# Altium schematic sheet io.SchDoc
size A; SheetNumber: 1; SheetTotal: 7
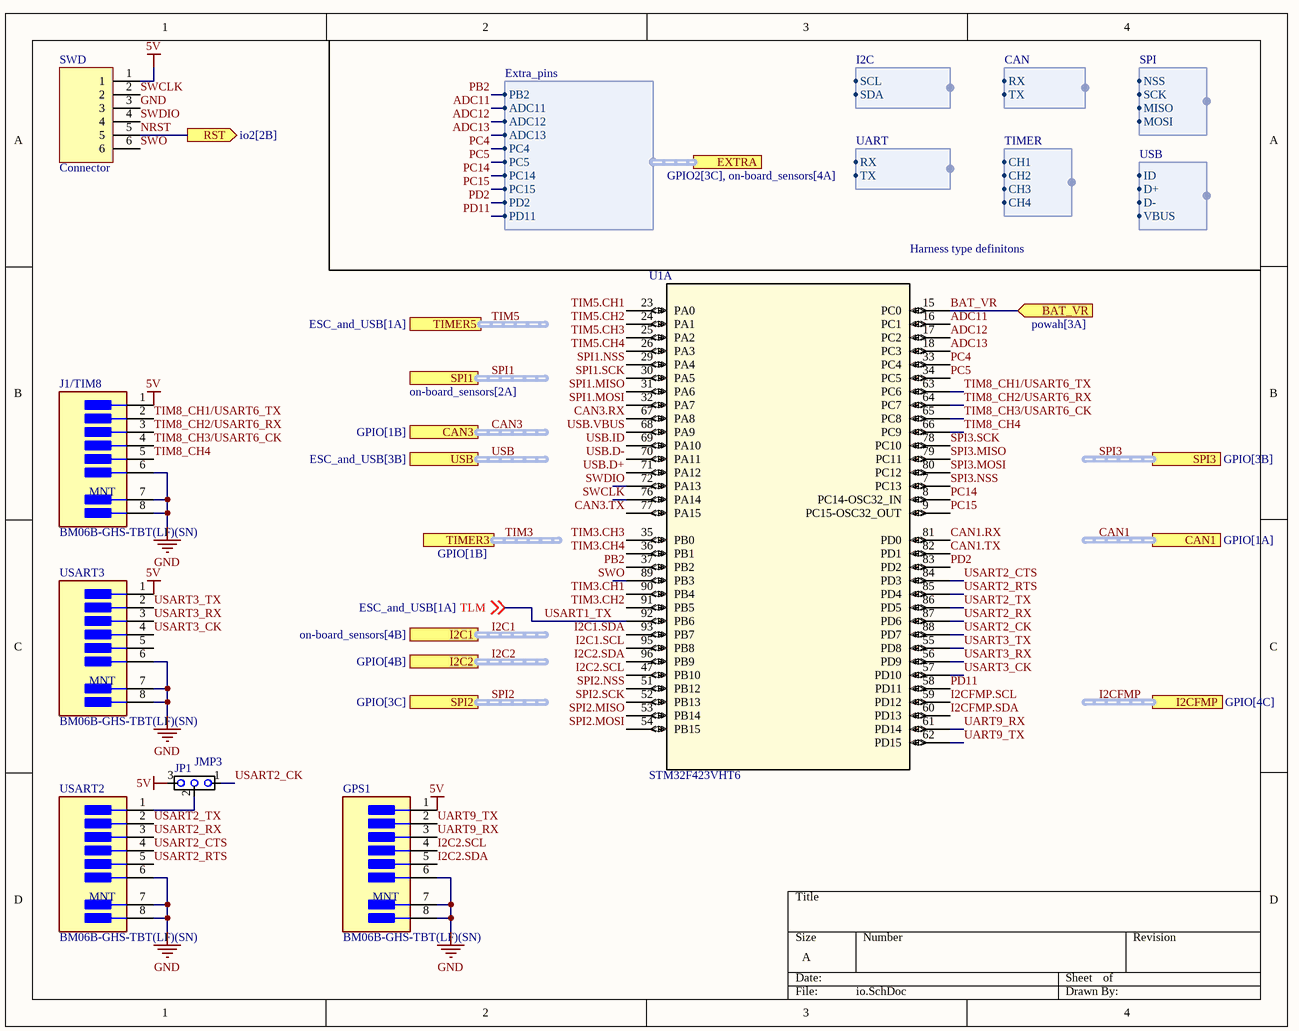
[diagram p0: io.SchDoc]

## Parts
GPS1  BM06B-GHS-TBT(LF)(SN)  [FP-SM06B-GHS-TB_LF_SN-MFG]
J1/TIM8  BM06B-GHS-TBT(LF)(SN)  [FP-SM06B-GHS-TB_LF_SN-MFG]
JP1  JMP3  [JMP3]
SWD  Connector  [FP_CONN6_TAP_254MM]
U1  STM32F423VHT6  [LQFP100-14x14mm]  (part A of 3)
USART2  BM06B-GHS-TBT(LF)(SN)  [FP-SM06B-GHS-TB_LF_SN-MFG]
USART3  BM06B-GHS-TBT(LF)(SN)  [FP-SM06B-GHS-TB_LF_SN-MFG]

## Ports
BAT_VR (in, see powah[3A]), CAN1 (harness CAN, see GPIO[1A]), CAN3 (harness CAN, see GPIO[1B]), EXTRA (harness Extra_pins, see GPIO2[3C], on-board_sensors[4A]), I2C1 (harness I2C, see on-board_sensors[4B]), I2C2 (harness I2C, see GPIO[4B]), I2CFMP (harness I2C, see GPIO[4C]), RST (out, see io2[2B]), SPI1 (harness SPI, see on-board_sensors[2A]), SPI2 (harness SPI, see GPIO[3C]), SPI3 (harness SPI, see GPIO[3B]), TIMER3 (harness TIMER, see GPIO[1B]), TIMER5 (harness TIMER, see ESC_and_USB[1A]), USB (harness USB, see ESC_and_USB[3B])

## Harnesses
USB: ID, D+, D-, VBUS
SPI: NSS, SCK, MISO, MOSI
TIMER: CH1, CH2, CH3, CH4
CAN: RX, TX
I2C: SCL, SDA
Extra_pins: PB2, ADC11, ADC12, ADC13, PC4, PC5, PC14, PC15, PD2, PD11
UART: RX, TX

## Nets
5V: GPS1.1 J1/TIM8.1 JP1.3 SWD.1 USART3.1
GND: GPS1.6 GPS1.7(MNT_1) GPS1.8(MNT_2) J1/TIM8.6 J1/TIM8.7(MNT_1) J1/TIM8.8(MNT_2) SWD.3 USART2.6 USART2.7(MNT_1) USART2.8(MNT_2) USART3.6 USART3.7(MNT_1) USART3.8(MNT_2)
ADC11: U1.16(PC1) ; port EXTRA.ADC11
ADC12: U1.17(PC2) ; port EXTRA.ADC12
ADC13: U1.18(PC3) ; port EXTRA.ADC13
BAT_VR: U1.15(PC0) ; port BAT_VR
CAN1.RX: U1.81(PD0)
CAN1.TX: U1.82(PD1)
CAN3.RX: U1.67(PA8)
CAN3.TX: U1.77(PA15)
I2C1.SCL: U1.95(PB8)
I2C1.SDA: U1.93(PB7)
I2C2.SCL: GPS1.4 U1.47(PB10)
I2C2.SDA: GPS1.5 U1.96(PB9)
I2CFMP.SCL: U1.59(PD12)
I2CFMP.SDA: U1.60(PD13)
NRST: SWD.5 ; port RST
PB2: U1.37(PB2) ; port EXTRA.PB2
PC4: U1.33(PC4) ; port EXTRA.PC4
PC5: U1.34(PC5) ; port EXTRA.PC5
PC14: U1.8(PC14-OSC32_IN) ; port EXTRA.PC14
PC15: U1.9(PC15-OSC32_OUT) ; port EXTRA.PC15
PD2: U1.83(PD2) ; port EXTRA.PD2
PD11: U1.58(PD11) ; port EXTRA.PD11
SPI1.MISO: U1.31(PA6)
SPI1.MOSI: U1.32(PA7)
SPI1.NSS: U1.29(PA4)
SPI1.SCK: U1.30(PA5)
SPI2.MISO: U1.53(PB14)
SPI2.MOSI: U1.54(PB15)
SPI2.NSS: U1.51(PB12)
SPI2.SCK: U1.52(PB13)
SPI3.MISO: U1.79(PC11)
SPI3.MOSI: U1.80(PC12)
SPI3.NSS: U1.7(PC13)
SPI3.SCK: U1.78(PC10)
SWCLK: SWD.2 U1.76(PA14)
SWDIO: SWD.4 U1.72(PA13)
SWO: SWD.6 U1.89(PB3)
TIM3.CH1: U1.90(PB4)
TIM3.CH2: U1.91(PB5)
TIM3.CH3: U1.35(PB0)
TIM3.CH4: U1.36(PB1)
TIM5.CH1: U1.23(PA0)
TIM5.CH2: U1.24(PA1)
TIM5.CH3: U1.25(PA2)
TIM5.CH4: U1.26(PA3)
TIM8_CH1/USART6_TX: J1/TIM8.2 U1.63(PC6)
TIM8_CH2/USART6_RX: J1/TIM8.3 U1.64(PC7)
TIM8_CH3/USART6_CK: J1/TIM8.4 U1.65(PC8)
TIM8_CH4: J1/TIM8.5 U1.66(PC9)
UART9_RX: GPS1.3 U1.61(PD14)
UART9_TX: GPS1.2 U1.62(PD15)
USART1_TX: U1.92(PB6) ; off-sheet TLM  [also labelled TLM]
USART2_CK: JP1.1 U1.88(PD7)
USART2_CTS: U1.84(PD3) USART2.4
USART2_RTS: U1.85(PD4) USART2.5
USART2_RX: U1.87(PD6) USART2.3
USART2_TX: U1.86(PD5) USART2.2
USART3_CK: U1.57(PD10) USART3.4
USART3_RX: U1.56(PD9) USART3.3
USART3_TX: U1.55(PD8) USART3.2
USB.D+: U1.71(PA12)
USB.D-: U1.70(PA11)
USB.ID: U1.69(PA10)
USB.VBUS: U1.68(PA9)
NetJP1_2: JP1.2 USART2.1

Not connected (* = marked no-connect by the designer): USART3 5

## Buses and harness runs
harness CAN1 = port CAN1
harness CAN3 = port CAN3
harness I2C1 = port I2C1
harness I2C2 = port I2C2
harness I2CFMP = port I2CFMP
harness SPI1 = port SPI1
harness SPI2 = port SPI2
harness SPI3 = port SPI3
harness TIM3 = port TIMER3
harness TIM5 = port TIMER5
harness USB = port USB

## Notes on the sheet
- Harness type definitons
- (in symbol CMP-17439-000166-1) MNT

## Library data of the parts
GPS1 J1/TIM8 USART2 USART3 = CMP-17439-000166-1: 6p; Pitch: 1.25mm; Number of Contacts: 6; Current Rating: 1A; Voltage Rating: 50V; Housing Material: Nylon; Lead Free: Lead Free; Packaging: Cut Tape; Number of Rows: 1; Series: GH; Contact Material: Bronze; Orientation: Straight; Termination: Solder; Mount: Surface Mount; Housing Color: Natural; Number of Positions: 6
SWD = Connector_6pin: 6pin connector
U1 = STM32F423VHT6: No Description Available; Mfr_Name: STMicroelectronics; RefDes: RefDes; Type: Type